# Altium schematic sheet Power_Supply.SchDoc: =SheetTitle_Top
size 420 x 297 mm; EDA_Number: ARTIQ; Author: G.Kasprowicz; CompanyName: WUT ISE; DrawnBy: G.Kasprowicz; Organization: WUT ISE; Address1: PW ISE; Address2: Nowowiejska 15/19 00-665 Warsaw; Address3: gkasprow@gmail.com; ModifiedBy: -; CheckedDate: -; Title2: Power Supply; DivGrp: WUT ISE; Designer: G.Kasprowicz; ModifiedDate: -; ProjectName: Sensor Box
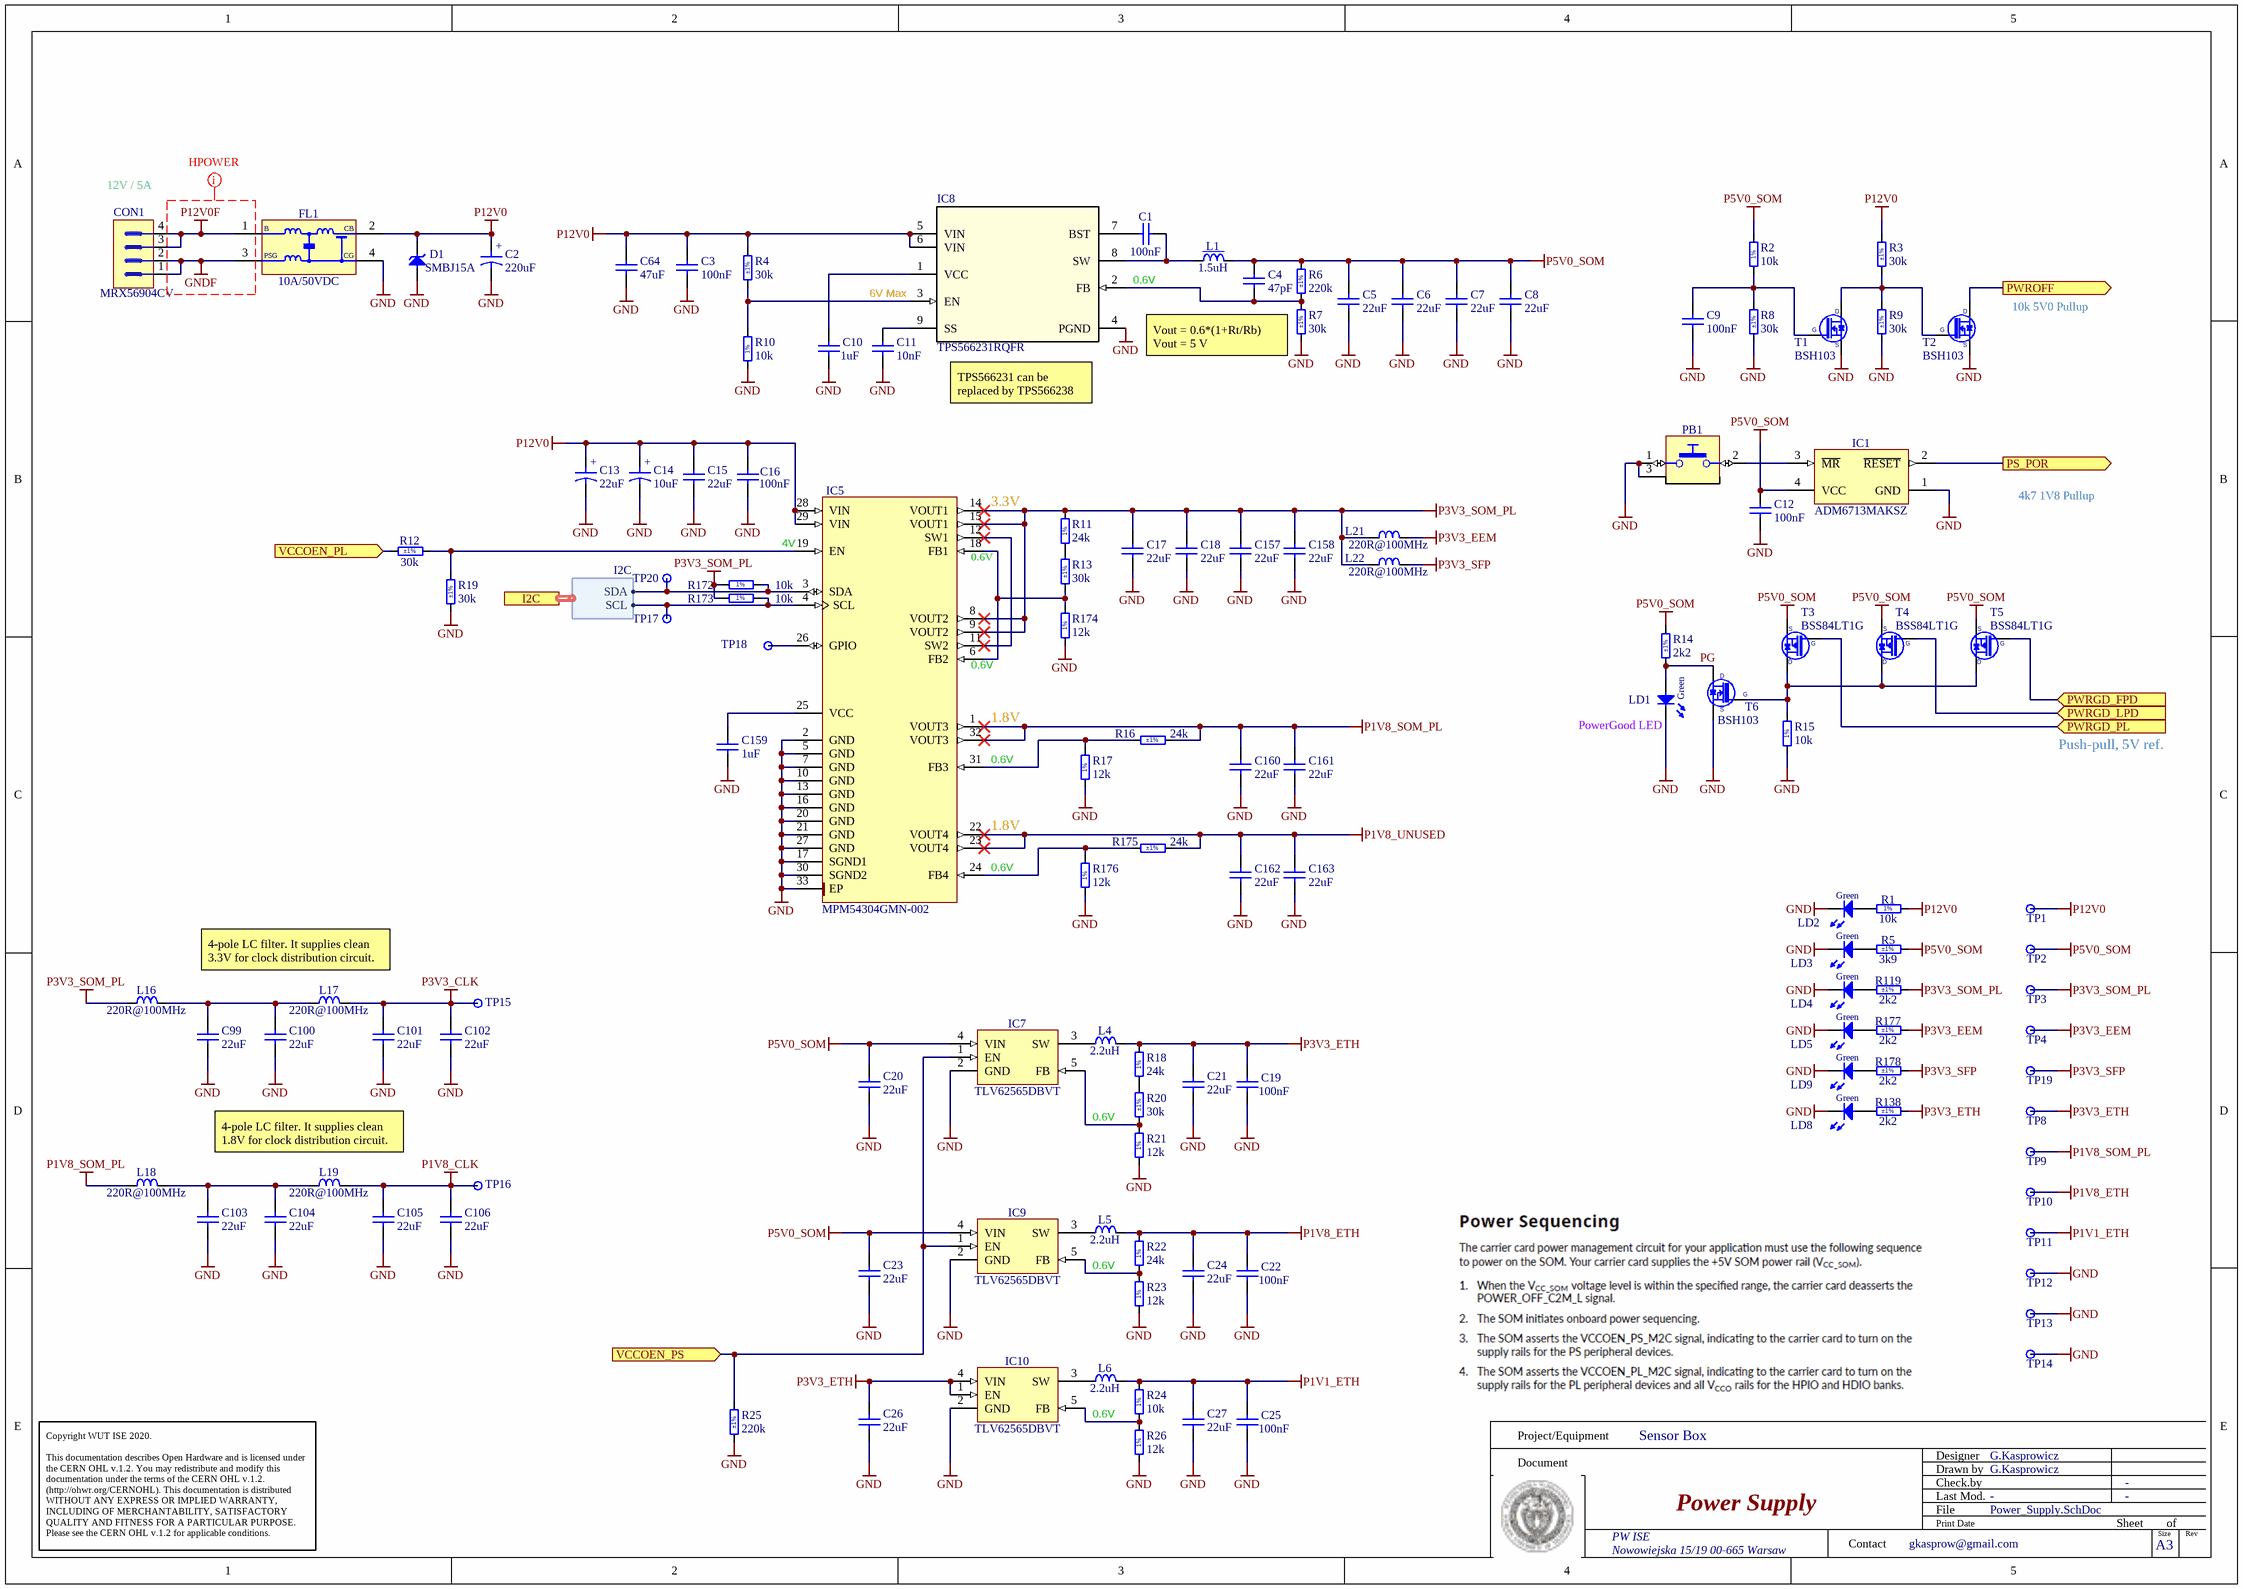
[diagram p0: Power_Supply.SchDoc]

## Parts
C1  100nF  [CAPC1005X55N]
C2  220uF  [CAPAE830X620N]
C3  100nF  [CAPC1005X55N]
C4  47pF  [CAPC1005X55N]
C5  22uF  [CAPC2012X135N]
C6  22uF  [CAPC2012X135N]
C7  22uF  [CAPC2012X135N]
C8  22uF  [CAPC2012X135N]
C9  100nF  [CAPC1005X55N]
C10  1uF  [CAPC1005X55N]
C11  10nF  [CAPC1005X55N]
C12  100nF  [CAPC1005X55N]
C13  22uF  [CAPMP3528X210N]
C14  10uF  [CAPMP3216X180N]
C15  22uF  [CAPC2012X135N]
C16  100nF  [CAPC1005X55N]
C17  22uF  [CAPC2012X135N]
C18  22uF  [CAPC2012X135N]
C19  100nF  [CAPC1005X55N]
C20  22uF  [CAPC2012X135N]
C21  22uF  [CAPC2012X135N]
C22  100nF  [CAPC1005X55N]
C23  22uF  [CAPC2012X135N]
C24  22uF  [CAPC2012X135N]
C25  100nF  [CAPC1005X55N]
C26  22uF  [CAPC2012X135N]
C27  22uF  [CAPC2012X135N]
C64  47uF  [CAPC3216X180N]
C99  22uF  [CAPC1709X100N]
C100  22uF  [CAPC1709X100N]
C101  22uF  [CAPC1709X100N]
C102  22uF  [CAPC1709X100N]
C103  22uF  [CAPC1709X100N]
C104  22uF  [CAPC1709X100N]
C105  22uF  [CAPC1709X100N]
C106  22uF  [CAPC1709X100N]
C157  22uF  [CAPC2012X135N]
C158  22uF  [CAPC2012X135N]
C159  1uF  [CAPC1005X55N]
C160  22uF  [CAPC2012X135N]
C161  22uF  [CAPC2012X135N]
C162  22uF  [CAPC2012X135N]
C163  22uF  [CAPC2012X135N]
CON1  MRX56904CV  [MRX56904CV]
D1  SMBJ15A  [DIOM5336X265N]
FL1  10A/50VDC  [FIL_MURATA_BNX02]
IC1  ADM6713MAKSZ  [SOT130P210X110-4N_a]
IC5  MPM54304GMN-002  [MPS_MPM54304GMN]
IC7  TLV62565DBVT  [SOT95P280X145-5N]
IC8  TPS566231RQFR  [RQF0009A]
IC9  TLV62565DBVT  [SOT95P280X145-5N]
IC10  TLV62565DBVT  [SOT95P280X145-5N]
L1  1.5uH  [IND_COILCRAFT_XAL4020]
L4  2.2uH  [IND_WURTH_WE-PMCI_0806LR]
L5  2.2uH  [IND_WURTH_WE-PMCI_0806LR]
L6  2.2uH  [IND_WURTH_WE-PMCI_0806LR]
L16  220R@100MHz  [INDC2012X105N]
L17  220R@100MHz  [INDC2012X105N]
L18  220R@100MHz  [INDC2012X105N]
L19  220R@100MHz  [INDC2012X105N]
L21  220R@100MHz  [INDC2012X105N]
L22  220R@100MHz  [INDC2012X105N]
LD1  Green  [LED_DIALIGHT_555-230]
LD2  Green  [LED_KINGBRIGHT_KPH-1608CGCK]
LD3  Green  [LED_KINGBRIGHT_KPH-1608CGCK]
LD4  Green  [LED_KINGBRIGHT_KPH-1608CGCK]
LD5  Green  [LED_KINGBRIGHT_KPH-1608CGCK]
LD8  Green  [LED_KINGBRIGHT_KPH-1608CGCK]
LD9  Green  [LED_KINGBRIGHT_KPH-1608CGCK]
PB1  (no value)  [PB_OMRON_B3U-1100P]
R1  10k  [RESC1005X40N]
R2  10k  [RESC1005X40N]
R3  30k  Tolerance: ±1%  [RESC1005X40N]
R4  30k  Tolerance: ±1%  [RESC1005X40N]
R5  3k9  Tolerance: ±1%  [RESC1005X40N]
R6  220k  Tolerance: ±1%  [RESC1005X40N]
R7  30k  Tolerance: ±1%  [RESC1005X40N]
R8  30k  Tolerance: ±1%  [RESC1005X40N]
R9  30k  Tolerance: ±1%  [RESC1005X40N]
R10  10k  [RESC1005X40N]
R11  24k  [RESC1005X40N]
R12  30k  Tolerance: ±1%  [RESC1005X40N]
R13  30k  Tolerance: ±1%  [RESC1005X40N]
R14  2k2  Tolerance: ±1%  [RESC1005X40N]
R15  10k  [RESC1005X40N]
R16  24k  Tolerance: ±1%  [RESC1005X40N]
R17  12k  [RESC1005X40N]
R18  24k  [RESC1005X40N]
R19  30k  Tolerance: ±1%  [RESC1005X40N]
R20  30k  Tolerance: ±1%  [RESC1005X40N]
R21  12k  [RESC1005X40N]
R22  24k  [RESC1005X40N]
R23  12k  [RESC1005X40N]
R24  10k  [RESC1005X40N]
R25  220k  Tolerance: ±1%  [RESC1005X40N]
R26  12k  [RESC1005X40N]
R119  2k2  Tolerance: ±1%  [RESC1005X40N]
R138  2k2  Tolerance: ±1%  [RESC1005X40N]
R172  10k  [RESC1005X40N]
R173  10k  [RESC1005X40N]
R174  12k  [RESC1005X40N]
R175  24k  Tolerance: ±1%  [RESC1005X40N]
R176  12k  [RESC1005X40N]
R177  2k2  Tolerance: ±1%  [RESC1005X40N]
R178  2k2  Tolerance: ±1%  [RESC1005X40N]
T1  BSH103  [SOT95P230X110-3N]
T2  BSH103  [SOT95P230X110-3N]
T3  BSS84LT1G  [SOT95P240X110-3N]
T4  BSS84LT1G  [SOT95P240X110-3N]
T5  BSS84LT1G  [SOT95P240X110-3N]
T6  BSH103  [SOT95P230X110-3N]
TP1  Test Point  [TPS127]  (value not drawn)  (no BOM)
TP2  Test Point  [TPS127]  (value not drawn)  (no BOM)
TP3  Test Point  [TPS127]  (value not drawn)  (no BOM)
TP4  Test Point  [TPS127]  (value not drawn)  (no BOM)
TP8  Test Point  [TPS127]  (value not drawn)  (no BOM)
TP9  Test Point  [TPS127]  (value not drawn)  (no BOM)
TP10  Test Point  [TPS127]  (value not drawn)  (no BOM)
TP11  Test Point  [TPS127]  (value not drawn)  (no BOM)
TP12  Test Point  [TPS127]  (value not drawn)  (no BOM)
TP13  Test Point  [TPS127]  (value not drawn)  (no BOM)
TP14  Test Point  [TPS127]  (value not drawn)  (no BOM)
TP15  Test Point  [TPS127]  (value not drawn)  (no BOM)
TP16  Test Point  [TPS127]  (value not drawn)  (no BOM)
TP17  Test Point  [TPS127]  (value not drawn)  (no BOM)
TP18  Test Point  [TPS127]  (value not drawn)  (no BOM)
TP19  Test Point  [TPS127]  (value not drawn)  (no BOM)
TP20  Test Point  [TPS127]  (value not drawn)  (no BOM)

## Ports
I2C (harness I2C), PS_POR (out), PWRGD_FPD (in), PWRGD_LPD (in), PWRGD_PL (in), PWROFF (out), VCCOEN_PL (in), VCCOEN_PS (in)

## Harnesses
I2C: SCL, SDA

## Nets
GND: C2.2 C3.1 C5.1 C6.1 C7.1 C8.1 C9.1 C10.1 C11.1 C12.1 C13.2 C14.2 C15.1 C16.1 C17.1 C18.1 C19.1 C20.1 C21.1 C22.1 C23.1 C24.1 C25.1 C26.1 C27.1 C64.1 C99.1 C100.1 C101.1 C102.1 C103.1 C104.1 C105.1 C106.1 C157.1 C158.1 C159.1 C160.1 C161.1 C162.1 C163.1 D1.2(A) FL1.4(CG) IC1.1(GND) IC5.2(GND) IC5.5(GND) IC5.7(GND) IC5.10(GND) IC5.13(GND) IC5.16(GND) IC5.17(SGND1) IC5.20(GND) IC5.21(GND) IC5.27(GND) IC5.30(SGND2) IC5.33(EP) IC7.2(GND) IC8.4(PGND) IC9.2(GND) IC10.2(GND) LD1.1(C) LD2.1(C) LD3.1(C) LD4.1(C) LD5.1(C) LD8.1(C) LD9.1(C) PB1.1 PB1.3 R7.1 R8.1 R9.1 R10.1 R15.1 R17.1 R19.1 R21.1 R23.1 R25.1 R26.1 R174.1 R176.1 T1.2(S) T2.2(S) T6.2(S) TP12.1 TP13.1 TP14.1
GNDF: CON1.1 CON1.2 FL1.3(PSG)
P1V1_ETH: C25.2 C27.2 L6.2 R24.2 TP11.1
P1V8_CLK: C105.2 C106.2 L19.2 TP16.1
P1V8_ETH: C22.2 C24.2 L5.2 R22.2 TP10.1
P1V8_SOM_PL: C160.2 C161.2 IC5.1(VOUT3) IC5.32(VOUT3) L18.1 R16.2 TP9.1
P1V8_UNUSED: C162.2 C163.2 IC5.22(VOUT4) IC5.23(VOUT4) R175.2
P3V3_CLK: C101.2 C102.2 L17.2 TP15.1
P3V3_EEM: L21.2 R177.2 TP4.1
P3V3_ETH: C19.2 C21.2 C26.2 IC10.1(EN) IC10.4(VIN) L4.2 R18.2 R138.2 TP8.1
P3V3_SFP: L22.2 R178.2 TP19.1
P3V3_SOM_PL: C17.2 C18.2 C157.2 C158.2 IC5.8(VOUT2) IC5.9(VOUT2) IC5.14(VOUT1) IC5.15(VOUT1) L16.1 L21.1 L22.1 R11.2 R119.2 R172.1 R173.1 TP3.1
P5V0_SOM: C4.2 C5.2 C6.2 C7.2 C8.2 C12.2 C20.2 C23.2 IC1.4(VCC) IC7.4(VIN) IC9.4(VIN) L1.2 R2.2 R5.2 R6.2 R14.2 T3.2(S) T4.2(S) T5.2(S) TP2.1
P12V0: C2.1 C3.2 C13.1 C14.1 C15.2 C16.2 C64.2 D1.1(C) FL1.2(CB) IC5.28(VIN) IC5.29(VIN) IC8.5(VIN) IC8.6(VIN) R1.2 R3.2 R4.2 TP1.1
P12V0F: CON1.3 CON1.4 FL1.1(B)
PG: LD1.2(A) R14.1 T6.3(D)
PS_POR: IC1.2(~{RESET}) ; port PS_POR
PWRGD_FPD: T5.1(G) ; port PWRGD_FPD
PWRGD_LPD: T4.1(G) ; port PWRGD_LPD
PWRGD_PL: T3.1(G) ; port PWRGD_PL
PWROFF: T2.3(D) ; port PWROFF
VCCOEN_PL: R12.1 ; port VCCOEN_PL
VCCOEN_PS: IC7.1(EN) IC9.1(EN) R25.2 ; port VCCOEN_PS
NetC1_1: C1.1 IC8.8(SW) L1.1
NetC1_2: C1.2 IC8.7(BST)
NetC4_1: C4.1 IC8.2(FB) R6.1 R7.2
NetC9_2: C9.2 R2.1 R8.2 T1.1(G)
NetC10_2: C10.2 IC8.1(VCC)
NetC11_2: C11.2 IC8.9(SS)
NetC99_2: C99.2 C100.2 L16.2 L17.1
NetC103_2: C103.2 C104.2 L18.2 L19.1
NetC159_2: C159.2 IC5.25(VCC)
NetIC1_3: IC1.3(~{MR}) PB1.2
NetIC5_3: IC5.3(SDA) R172.2 TP20.1 ; port I2C.SDA
NetIC5_4: IC5.4(SCL) R173.2 TP17.1 ; port I2C.SCL
NetIC5_6: IC5.6(FB2) IC5.18(FB1) R13.1 R174.2
NetIC5_11: IC5.11(SW2) IC5.12(SW1)
NetIC5_19: IC5.19(EN) R12.2 R19.2
NetIC5_24: IC5.24(FB4) R175.1 R176.2
NetIC5_26: IC5.26(GPIO) TP18.1
NetIC5_31: IC5.31(FB3) R16.1 R17.2
NetIC7_3: IC7.3(SW) L4.1
NetIC7_5: IC7.5(FB) R20.1 R21.2
NetIC8_3: IC8.3(EN) R4.1 R10.2
NetIC9_3: IC9.3(SW) L5.1
NetIC9_5: IC9.5(FB) R22.1 R23.2
NetIC10_3: IC10.3(SW) L6.1
NetIC10_5: IC10.5(FB) R24.1 R26.2
NetLD2_2: LD2.2(A) R1.1
NetLD3_2: LD3.2(A) R5.1
NetLD4_2: LD4.2(A) R119.1
NetLD5_2: LD5.2(A) R177.1
NetLD8_2: LD8.2(A) R138.1
NetLD9_2: LD9.2(A) R178.1
NetR3_1: R3.1 R9.2 T1.3(D) T2.1(G)
NetR11_1: R11.1 R13.2
NetR15_2: R15.2 T3.3(D) T4.3(D) T5.3(D) T6.1(G)
NetR18_1: R18.1 R20.2

## Layout directives
net class Hpower; rule Routing Via Style [Pref Size = 0.7mm    Pref Hole Size = 0.5mm]; rule Width Constraint [Pref Width = 20mil    Min Width = 15mil    Max Width = 50mil]: GNDF, P12V0F

## Notes on the sheet
- (near CON1) 12V / 5A
- 6V Max
- 0.6V
- (near T2) 10k 5V0 Pullup
- (near IC8) TPS566231 can be replaced by TPS566238
- (near R7) Vout = 0.6*(1+Rt/Rb)
  Vout = 5 V
- 3.3V
- 4k7 1V8 Pullup
- 4V
- (near IC5) 0.6V
- (near IC5) 1.8V
- (near LD1) PowerGood LED
- Push-pull, 5V ref.
- (near L17) 4-pole LC filter. It supplies clean 3.3V for clock distribution circuit.
- (near L19) 4-pole LC filter. It supplies clean 1.8V for clock distribution circuit.
- Project/Equipment
- Document
- Designer
- Drawn by
- Check.by
- Copyright WUT ISE 2020.
  This documentation describes Open Hardware and is licensed under the CERN OHL v.1.2. You may redistribute and modify this documentation under the terms of the CERN OHL v.1.2. (http://ohwr.org/CERNOHL). This documentation is distributed WITHOUT ANY EXPRESS OR IMPLIED WARRANTY, INCLUDING OF MERCHANTABILITY, SATISFACTORY QUALITY AND FITNESS FOR A PARTICULAR PURPOSE. Please see the CERN OHL v.1.2 for applicable conditions.
- Contact
- File
- Last Mod.
- Print Date
- Sheet
- Size
- A3
- of
- Rev
- (in symbol CAE830-620_220UF_16V_20%) +
- (in symbol CTE3216-18_10UF_16V_20%_AVX_TCJ) +
- (in symbol CTE3528-21_22UF_10V_10%_LESR0700) +
- (in symbol R0402_10K_1%_0.0625W_100PPM) 1%
- (in symbol R0402_12K_1%_0.0625W_100PPM) 1%
- (in symbol R0402_24K_1%_0.0625W_100PPM) 1%

## Library data of the parts
C1 C3 C9 C12 C16 C19 C22 C25 = CC0402_100NF_16V_10%_X5R: Non-polarised capacitor; Part Description: SMD Multilayer Chip Ceramic Capacitor; Manufacturer: GENERIC; Manufacturer1 Part Number: GRM155R61C104KA88D; Voltage: 16V; TC: X5R; Tolerance: ±10%; Part Number: CC0402_100NF_16V_10%_X5R; Component Kind: Standard; Component Type: Standard; Pin Count: 2; Value: 100nF; Status: None; Manufacturer Part Number: CC0402_100NF_16V_10%_X5R; Case: 0402; Mounted: Yes; Socket: No; SMD: Yes; Sense: No; Manufacturer1 Example: MURATA; Manufacturer1 ComponentHeight: 0.55mm; HelpURL: \\cern.ch\dfs\Applications\Altium\Datasheets\CC0402_X5R_MURATA_GRM.pdf; Author: CERN DEM JLC; CreateDate: 10.12.2013; LatestRevisionDate: 10.12.2013
C2 = CAE830-620_220UF_16V_20%: Polarised capacitor; Part Description: Aluminum Electrolytic SMT Capacitor; Manufacturer: PANASONIC; Manufacturer Part Number: EEEFK1C221AP; Voltage: 16V; Tolerance: ±20%; Part Number: CAE830-620_220UF_16V_20%; Component Kind: Standard; Component Type: Standard; Pin Count: 2; Value: 220uF; Status: Not Recommended; Case: E; Mounted: Yes; Socket: No; SMD: Yes; Sense: No; ComponentHeight: 6.2mm; HelpURL: \\cern.ch\dfs\Applications\Altium\Datasheets\CAE_PANASONIC_FK.pdf; Author: CERN DEM JLC; CreateDate: 03.12.2007; LatestRevisionDate: 05.11.2014
C4 = CC0402_47PF_50V_5%_C0G: Non-polarised capacitor; Part Description: SMD Multilayer Chip Ceramic Capacitor; Manufacturer: GENERIC; Manufacturer1 Part Number: C0402C470J5GACTU; Voltage: 50V; TC: C0G/NP0; Tolerance: ±5%; Part Number: CC0402_47PF_50V_5%_C0G; Component Kind: Standard; Component Type: Standard; Pin Count: 2; Value: 47pF; Status: Preferred; Manufacturer Part Number: CC0402_47PF_50V_5%_C0G; Case: 0402; Mounted: Yes; Socket: No; SMD: Yes; Sense: No; Manufacturer1 Example: KEMET; Manufacturer1 ComponentHeight: 0.55mm; HelpURL: \\cern.ch\dfs\Applications\Altium\Datasheets\CC0402_C0G_KEMET_(Commercial Grade).pdf; Author: CERN DEM JLC; CreateDate: 03.12.2007; LatestRevisionDate: 22.04.2015
C5-C8 C15 C17 C18 C157 C158 C160-C163 = CC0805_22UF_16V_10%_X5R: Non-polarised capacitor; Manufacturer: GENERIC; Part Description: SMD Multilayer Chip Ceramic Capacitor; Manufacturer1 Part Number: C2012X5R1C226KT; Tolerance: ±10%; Voltage: 16V; TC: X5R; Manufacturer Part Number: CC0805_22UF_16V_10%_X5R; Part Number: CC0805_22UF_16V_10%_X5R; Value: 22uF; Component Kind: Standard; Component Type: Standard; Pin Count: 2; Status: Preferred; Case: 0805; Mounted: Yes; Socket: No; SMD: Yes; Sense: No; Manufacturer1 Example: TDK; Manufacturer1 ComponentHeight: 1.35mm; HelpURL: \\cern.ch\dfs\Applications\Altium\Datasheets\CC0805_X5R_TDK_C.pdf; Author: CERN DEM JLC; CreateDate: 25.10.2012; LatestRevisionDate: 25.10.2012
C10 C159 = CC0402_1UF_16V_10%_X5R: Non-polarised capacitor; Part Description: SMD Multilayer Chip Ceramic Capacitor; Manufacturer: GENERIC; Manufacturer1 Part Number: C1005X5R1C105KT; Voltage: 16V; TC: X5R; Tolerance: ±10%; Part Number: CC0402_1UF_16V_10%_X5R; Component Kind: Standard; Component Type: Standard; Pin Count: 2; Value: 1uF; Status: Preferred; Manufacturer Part Number: CC0402_1UF_16V_10%_X5R; Case: 0402; Mounted: Yes; Socket: No; SMD: Yes; Sense: No; Manufacturer1 Example: TDK; Manufacturer1 ComponentHeight: 0.55mm; HelpURL: \\cern.ch\dfs\Applications\Altium\Datasheets\CC0402_X5R_TDK_C.pdf; Author: CERN DEM JLC
  C10: CreateDate: 2012-10-25; LatestRevisionDate: 2012-10-25
  C159: CreateDate: 25.10.2012; LatestRevisionDate: 25.10.2012
C11 = CC0402_10NF_16V_10%_X7R: Non-polarised capacitor; Part Description: SMD Multilayer Chip Ceramic Capacitor; Manufacturer: GENERIC; Manufacturer1 Part Number: 223878715636; Voltage: 16V; TC: X7R; Tolerance: ±10%; Part Number: CC0402_10NF_16V_10%_X7R; Component Kind: Standard; Component Type: Standard; Pin Count: 2; Value: 10nF; Status: Not Recommended; Manufacturer Part Number: CC0402_10NF_16V_10%_X7R; Case: 0402; Mounted: Yes; Socket: No; SMD: Yes; Sense: No; Manufacturer1 Example: PHYCOMP; Manufacturer1 ComponentHeight: 0.55mm; HelpURL: \\cern.ch\dfs\Applications\Altium\Datasheets\CC0402_X7R_PHYCOMP.pdf; Author: CERN DEM JLC; CreateDate: 03.12.2007; LatestRevisionDate: 03.12.2007
C13 = CTE3528-21_22UF_10V_10%_LESR0700: Polarised capacitor; Part Description: Low ESR 0R7 Solid Tantalum Chip Capacitor; Manufacturer: GENERIC; Manufacturer1 Part Number: TPSB226K010R0700; Voltage: 10V; Tolerance: ±10%; Part Number: CTE3528-21_22UF_10V_10%_LESR0700; Component Kind: Standard; Component Type: Standard; Pin Count: 2; Value: 22uF; Status: Preferred; Manufacturer Part Number: CTE3528-21_22UF_10V_10%_LESR0700; Case: B; Mounted: Yes; Socket: No; SMD: Yes; Sense: No; Manufacturer1 Example: AVX; Manufacturer1 ComponentHeight: 2.1mm; HelpURL: \\cern.ch\dfs\Applications\Altium\Datasheets\CTE-LESR_AVX_TPS.pdf; Author: CERN DEM JLC; CreateDate: 05.05.2008; LatestRevisionDate: 20.01.2009
C14 = CTE3216-18_10UF_16V_20%_AVX_TCJ: Polarised capacitor; Part Description: ESR 0R200 Tantalum Solid Electrolytic Chip Capacitor with Conductive Polymer Electrode; Manufacturer: AVX; Manufacturer Part Number: TCJA106M016R0200; Voltage: 16V; Tolerance: ±20%; Part Number: CTE3216-18_10UF_16V_20%_AVX_TCJ; Component Kind: Standard; Component Type: Standard; Pin Count: 2; Value: 10uF; Status: Preferred; Case: A; Mounted: Yes; Socket: No; SMD: Yes; Sense: No; ComponentHeight: 1.8mm; HelpURL: \\cern.ch\dfs\Applications\Altium\Datasheets\CTE_AVX_TCJ.pdf; Author: CERN DEM JLC; CreateDate: 29.03.2012; LatestRevisionDate: 29.03.2012
C20 C21 C23 C24 C26 C27 = CC0805_22UF_16V_10%_X5R: Non-polarised capacitor; Part Description: SMD Multilayer Chip Ceramic Capacitor; Manufacturer: GENERIC; Manufacturer1 Part Number: C2012X5R1C226KT; Voltage: 16V; TC: X5R; Tolerance: ±10%; Part Number: CC0805_22UF_16V_10%_X5R; Component Kind: Standard; Component Type: Standard; Pin Count: 2; Value: 22uF; Status: Preferred; Manufacturer Part Number: CC0805_22UF_16V_10%_X5R; Case: 0805; Mounted: Yes; Socket: No; SMD: Yes; Sense: No; Manufacturer1 Example: TDK; Manufacturer1 ComponentHeight: 1.35mm; HelpURL: \\cern.ch\dfs\Applications\Altium\Datasheets\CC0805_X5R_TDK_C.pdf; Author: CERN DEM JLC; CreateDate: 25.10.2012; LatestRevisionDate: 25.10.2012
C64 = CC1206_47UF_25V_20%_X5R: Non-polarised capacitor; Part Description: SMD Multilayer Chip Ceramic Capacitor; Manufacturer: GENERIC; Manufacturer1 Part Number: C3216X5R1E476M160AC; Voltage: 25V; TC: X5R; Tolerance: ±20%; Part Number: CC1206_47UF_25V_20%_X5R; Component Kind: Standard; Component Type: Standard; Pin Count: 2; Value: 47uF; Status: None; Manufacturer Part Number: CC1206_47UF_25V_20%_X5R; Case: 1206; Mounted: Yes; Socket: No; SMD: Yes; Sense: No; Manufacturer1 Example: TDK; Manufacturer1 ComponentHeight: 1.8mm; HelpURL: \\cern.ch\dfs\Applications\Altium\Datasheets\CC1206_X5R_TDK_C.pdf; Author: CERN DEM JLC; CreateDate: 20.11.2013; LatestRevisionDate: 14.03.2017
C99-C106 = CC0603_22UF_6.3V_20%_X5R: Non-polarised capacitor; Part Description: SMD Multilayer Chip Ceramic Capacitor; Manufacturer: GENERIC; Manufacturer1 Part Number: C1608X5R0J226M080AC; Voltage: 6.3V; TC: X5R; Tolerance: ±20%; Part Number: CC0603_22UF_6.3V_20%_X5R; Component Kind: Standard; Component Type: Standard; Pin Count: 2; Value: 22uF; Status: None; Manufacturer Part Number: CC0603_22UF_6.3V_20%_X5R; Case: 0603; Mounted: Yes; Socket: No; SMD: Yes; Manufacturer1 Example: TDK; Manufacturer1 ComponentHeight: 1mm; HelpURL: \\cern.ch\dfs\Applications\Altium\Datasheets\CC0603_X5R_TDK_C.pdf; Author: CERN DEM JLC; CreateDate: 16/12/2013; LatestRevisionDate: 13/09/2016; Sense: No
CON1 = CON_CRIMP_4.2mm_RA_4: 4.2mm cripm terminal header; Manufacturer: Molex; Part Number: MRX56904CV; Manufacturer Part Number: MRX56904CV
D1 = SMBJ15A: Zener Diode; Part Description: Uni-Directional Transient Voltage Suppressor Diode; Manufacturer: FAIRCHILD SEMICONDUCTOR; Voltage: 15V; Power: 600W; PressFit: No; Bonding: No; Part Number: SMBJ15A; Component Kind: Standard; Component Type: Standard; Device: SMBJ15A; PackageDescription: DO-214-AA/SMB Diode, Molded Body; 5.34mm L X 3.625mm W X 2.65mm H, IPC Medium Density; Manufacturer Part Number: SMBJ15A; Pin Count: 2; Case: DO-214AA; Mounted: Yes; Socket: No; SMD: Yes; Sense: No; ComponentHeight: 2.65mm; HelpURL: \\cern.ch\dfs\Applications\Altium\Datasheets\SMBJ.pdf; Author: CERN DEM JLC; CreateDate: 08.12.2008; LatestRevisionDate: 19.12.2011
FL1 = FIL_MURATA_BNX022-01L: Block Type EMIFIL (LC Combined); Part Description: Block Type EMIFIL (LC Combined) SMD Type, BNX02* Series; Manufacturer: MURATA; Resistance: 0.5R; Part Number: FIL_MURATA_BNX022-01L; Component Kind: Standard; Component Type: Standard; Pin Count: 2; Value: 10A/50VDC; Status: None; Manufacturer Part Number: BNX022-01L; Mounted: Yes; Socket: No; SMD: Yes; Sense: No; ComponentHeight: 3.3mm; HelpURL: \\cern.ch\dfs\Applications\Altium\Datasheets\FIL_MURATA_BNX022-01L.pdf; Author: CERN DEM JLC; CreateDate: 10.10.2012; LatestRevisionDate: 10.10.2012
IC1 = ADM6713MAKSZ: Microprocessor Supervisory with Manual Reset; Part Description: 4.38V Supervisory Circuits with Manual Reset; Manufacturer: ANALOG DEVICES; PressFit: No; Bonding: No; Part Number: ADM6713MAKSZ; Component Kind: Standard; Component Type: Standard; Device: ADM6713MAKSZ; PackageDescription: SC70-4, SOT, 0.65mm Pitch, 4 pin, 1.25mm W X 2.10mm L X 1.10mm H, IPC Medium Density, Big Pad 2; Manufacturer Part Number: ADM6713MAKSZ; Pin Count: 4; Case: SC70-4; Mounted: Yes; Socket: No; SMD: Yes; Sense: No; ComponentHeight: 1.1mm; Author: CERN DEM MR; HelpURL: \\cern.ch\dfs\Applications\Altium\Datasheets\ADM6713.pdf; CreateDate: 11/01/2016; LatestRevisionDate: 21/08/2018
IC5 = MPM54304GMN-XXXX: Quad-Output Power Module with I2C and MTP; Part Description: 4V to 16V Input, Quad-Output Power Module with I2C and MTP; Manufacturer: MPS (MONOLITIC  POWER SYSTEMS); PressFit: No; Bonding: No; Part Number: MPM54304GMN-002; Component Kind: Standard; Component Type: Standard; Device: MPM54304GMN-002; PackageDescription: MPS LGA-33 Case, 0.65mm Pitch, Rect.; 32 Pin, 7.00mm L X 7.00mm W X 2.10mm H body (w/Thermal Tab 3.55 X 3.55mm); Manufacturer Part Number: MPM54304GMN-002; Pin Count: 33; Case: QFN32; Mounted: Yes; Socket: No; SMD: Yes; Sense: No; ComponentHeight: 2.1mm; HelpURL: \\cern.ch\dfs\Applications\Altium\Datasheets\MPM54304GMN.pdf; Author: CERN DEM BC; CreateDate: 09.11.2020; LatestRevisionDate: 23.11.2022
IC7 IC9 IC10 = TLV62565DBVT: 1.5A High Efficiency Step-Down Converter, Adjustable Output Voltage; Manufacturer: TEXAS INSTRUMENTS; PressFit: No; Bonding: No; Part Number: TLV62565DBVT; Component Kind: Standard; Component Type: Standard; Device: TLV62565DBVT; PackageDescription: SOT, 0.95mm Pitch; 5 Pin, 1.60mm W X 2.90mm L X 1.45mm H Body, IPC Medium Density; Part Description: 1.5A High Efficiency Step-Down Converter, Adjustable Output Voltage; Manufacturer Part Number: TLV62565DBVT; Pin Count: 5; Case: SOT23-5; Mounted: Yes; Socket: No; SMD: Yes; Sense: No; ComponentHeight: 1.45mm; HelpURL: \\cern.ch\dfs\Applications\Altium\Datasheets\TLV62565DBVT.pdf; Author: CERN DEM JMW; CreateDate: 29.08.2016; LatestRevisionDate: 29.08.2016
IC8 = PM_TPS566231RQFR: 3-V to 18-V input, 6-A synchronous step-down voltage regulator with pulse skip mode; Manufacturer: Texas Instruments; PartNumber: TPS566231RQFR; RefDes: RefDes; Type: DEV; Value: Value; Copyright: Copyright (C) 2021 Accelerated Designs. All rights reserved
L1 = IND_1.5UH_20%_COILCRAFT_XAL4020: Inductor With Core; Part Description: SMD Shielded Power Inductor; Manufacturer Part Number: XAL4030-152ME; Power: 5.2A; Resistance: 0.02145R; Tolerance: ±20%; Part Number: IND_1.5UH_20%_COILCRAFT_XAL4020; Component Kind: Standard; Component Type: Standard; Pin Count: 2; Value: 1.5uH; Status: None; Manufacturer: COILCRAFT; Mounted: Yes; Socket: No; SMD: Yes; Sense: No; ComponentHeight: 2.1mm; HelpURL: \\cern.ch\dfs\Applications\Altium\Datasheets\IND_COILCRAFT_XAL4020.pdf; Author: CERN DEM BC; CreateDate: 07.08.2019; LatestRevisionDate: 07.08.2019
L4-L6 = IND_2.2UH_20%_WURTH_WE-PMCI_74479276222C: Inductor; Part Description: SMD Power Molded Chip  Inductor (WE-PMCI Series); Manufacturer: WURTH ELEKTRONIK; Power: 1.1A; Resistance: 0.112R; Tolerance: ±20%; Part Number: IND_2.2UH_20%_WURTH_WE-PMCI_74479276222C; Component Kind: Standard; Component Type: Standard; Pin Count: 2; Value: 2.2uH; Status: None; Manufacturer Part Number: 74479276222C; Case: 0806; Mounted: Yes; Socket: No; SMD: Yes; Sense: No; ComponentHeight: 1mm; HelpURL: \\cern.ch\dfs\Applications\Altium\Datasheets\IND_WURTH_WE-PMCI_74479276222C.pdf; Author: CERN DEM JLC; CreateDate: 20.10.2016; LatestRevisionDate: 20.10.2016
L16-L19 L21 L22 = IND0805_MURATA_BLM21PG221SN1D: Inductor; Part Description: SMD EMIFIL Suppression Chip Ferrite Bead; Manufacturer: MURATA; Power: 2A; Resistance: 0.05R; Tolerance: ±25%; Table: Inductors SMD; Part Number: IND0805_MURATA_BLM21PG221SN1D; Component Kind: Standard; Component Type: Standard; Pin Count: 2; Value: 220R@100MHz; Status: None; Manufacturer Part Number: BLM21PG221SN1D; Case: 0805; Mounted: Yes; Socket: No; SMD: Yes; ComponentHeight: 1.05mm; HelpURL: \\cern.ch\dfs\Applications\Altium\Datasheets\IND0402_MURATA_BLM21P.pdf; Author: CERN DEM JLC; CreateDate: 25/01/2010; LatestRevisionDate: 25/01/2010
LD1 = LED_DIALIGHT_555-2301F: LED Green 1C 2A; Part Description: Single 2mm Green LED CBI® Circuit Board Indicator; PressFit: No; Bonding: No; Part Number: LED_DIALIGHT_555-2301F; Component Kind: Standard; Component Type: Standard; Color: Green; PackageDescription: Single 2mm Green LED, Body 5.08x2.54mm, Pin spacing 2.54mm; Manufacturer: DIALIGHT; Manufacturer Part Number: 555-2301F; Pin Count: 2; Mounted: Yes; Socket: No; SMD: No; Sense: No; ComponentHeight: 6.35mm; HelpURL: \\cern.ch\dfs\Applications\Altium\Datasheets\LED_DIALIGHT_555-2301F.pdf; Author: CERN DEM JMW; CreateDate: 22.09.2008; LatestRevisionDate: 17.03.2010
LD2-LD5 LD8 LD9 = LED_KINGBRIGHT_KPH-1608CGCK: LED Green 1C 2A; Part Description: SMD Green LED, Case 1.6mmX0.8mm(0603), 0.65mm Thickness; PressFit: No; Bonding: No; Part Number: LED_KINGBRIGHT_KPH-1608CGCK; Component Kind: Standard; Component Type: Standard; Color: Green; PackageDescription: SMT Green LED, Case 0603, Body L 1.6 x W 0.8mm H 0.65mm; Manufacturer: KINGBRIGHT; Manufacturer Part Number: KPH-1608CGCK; Pin Count: 2; Mounted: Yes; Socket: No; SMD: Yes; Sense: No; ComponentHeight: 0.65mm; HelpURL: \\cern.ch\dfs\Applications\Altium\Datasheets\LED_KINGBRIGHT_KPH-1608CGCK.pdf; Author: CERN DEM JLC; CreateDate: 03/07/2017; LatestRevisionDate: 03/07/2017
PB1 = PB_OMRON_B3U-1100P: Push-Button Switch SPDT; Part Description: 3x2.5mm Ultra-Small Tactile SPST Pushbutton Switch (with Ground Terminal),Contact Rating 50mA 12VDC, B3U Series; Manufacturer: OMRON; PressFit: No; Part Number: PB_OMRON_B3U-1100P; Component Kind: Standard; Component Type: Standard; Pin Count: 3; PackageDescription: Body 1.2x3x2.5mm Ultra-Small Tactile SPST Pushbutton Switch, (with Ground Terminal), OMRON B3U Series; Family: Push Button; Mounted: Yes; Socket: No; SMD: Yes; Sense: No; Status: None; Manufacturer Part Number: B3U-1100P; ComponentHeight: 1.75mm; HelpURL: \\cern.ch\dfs\Applications\Altium\Datasheets\PB_OMRON_B3U-1100P.pdf; Author: CERN DEM JLC; CreateDate: 3/16/2010; LatestRevisionDate: 6/16/2022
R1 R2 R10 R15 R24 R172 R173 = R0402_10K_1%_0.0625W_100PPM: Resistor - 1%; Part Description: General Purpose Thick Film Chip Resistor; Manufacturer: GENERIC; Manufacturer1 Part Number: 232270671003L; TC: ±100ppm/°C; PressFit: No; Part Number: R0402_10K_1%_0.0625W_100PPM; Component Kind: Standard; Component Type: Standard; Pin Count: 2; Value: 10k; Status: Not Recommended; Power: 0.0625W; Tolerance: ±1%; Manufacturer Part Number: R0402_10K_1%_0.0625W_100PPM; Case: 0402; Mounted: Yes; Sense: No; Socket: No; SMD: Yes; Manufacturer1 Example: YAGEO PHYCOMP; Manufacturer1 ComponentHeight: 0.4mm; HelpURL: \\cern.ch\dfs\Applications\Altium\Datasheets\R0402_Phycomp_RC0402.pdf; Author: CERN DEM JLC; CreateDate: 03.12.2007; LatestRevisionDate: 17.10.2012
R3 R4 R7-R9 R12 R13 R19 R20 = R0402_30K_1%_0.0625W_100PPM: Resistor - 1%; Part Description: General Purpose Thick Film Chip Resistor; Manufacturer: GENERIC; Manufacturer1 Part Number: 232270673003L; TC: ±100ppm/°C; PressFit: No; Part Number: R0402_30K_1%_0.0625W_100PPM; Component Kind: Standard; Component Type: Standard; Pin Count: 2; Value: 30k; Status: Not Recommended; Power: 0.0625W; Manufacturer Part Number: R0402_30K_1%_0.0625W_100PPM; Case: 0402; Mounted: Yes; Sense: No; Socket: No; SMD: Yes; Manufacturer1 Example: YAGEO PHYCOMP; Manufacturer1 ComponentHeight: 0.4mm; HelpURL: \\cern.ch\dfs\Applications\Altium\Datasheets\R0402_Phycomp_RC0402.pdf; Author: CERN DEM JLC; CreateDate: 03.12.2007; LatestRevisionDate: 17.10.2012
R5 = R0402_3K9_1%_0.0625W_100PPM: Resistor - 1%; Part Description: General Purpose Thick Film Chip Resistor; Manufacturer: GENERIC; Manufacturer1 Part Number: 232270673902L; TC: ±100ppm/°C; PressFit: No; Part Number: R0402_3K9_1%_0.0625W_100PPM; Component Kind: Standard; Component Type: Standard; Pin Count: 2; Value: 3k9; Status: Not Recommended; Power: 0.0625W; Manufacturer Part Number: R0402_3K9_1%_0.0625W_100PPM; Case: 0402; Mounted: Yes; Sense: No; Socket: No; SMD: Yes; Manufacturer1 Example: YAGEO PHYCOMP; Manufacturer1 ComponentHeight: 0.4mm; HelpURL: \\cern.ch\dfs\Applications\Altium\Datasheets\R0402_Phycomp_RC0402.pdf; Author: CERN DEM JLC; CreateDate: 03.12.2007; LatestRevisionDate: 17.10.2012
R6 R25 = R0402_220K_1%_0.0625W_100PPM: Resistor - 1%; Part Description: General Purpose Thick Film Chip Resistor; Manufacturer: GENERIC; Manufacturer1 Part Number: 232270672204L; TC: ±100ppm/°C; PressFit: No; Part Number: R0402_220K_1%_0.0625W_100PPM; Component Kind: Standard; Component Type: Standard; Pin Count: 2; Value: 220k; Status: Not Recommended; Power: 0.0625W; Manufacturer Part Number: R0402_220K_1%_0.0625W_100PPM; Case: 0402; Mounted: Yes; Sense: No; Socket: No; SMD: Yes; Manufacturer1 Example: YAGEO PHYCOMP; Manufacturer1 ComponentHeight: 0.4mm; HelpURL: \\cern.ch\dfs\Applications\Altium\Datasheets\R0402_Phycomp_RC0402.pdf; Author: CERN DEM JLC; CreateDate: 03.12.2007; LatestRevisionDate: 17.10.2012
R11 R16 R18 R22 R175 = R0402_24K_1%_0.0625W_100PPM: Resistor - 1%; Part Description: General Purpose Thick Film Chip Resistor; Manufacturer: GENERIC; Manufacturer1 Part Number: 232270672403L; TC: ±100ppm/°C; PressFit: No; Part Number: R0402_24K_1%_0.0625W_100PPM; Component Kind: Standard; Component Type: Standard; Pin Count: 2; Value: 24k; Status: Not Recommended; Power: 0.0625W; Manufacturer Part Number: R0402_24K_1%_0.0625W_100PPM; Case: 0402; Mounted: Yes; Sense: No; Socket: No; SMD: Yes; Manufacturer1 Example: YAGEO PHYCOMP; Manufacturer1 ComponentHeight: 0.4mm; HelpURL: \\cern.ch\dfs\Applications\Altium\Datasheets\R0402_Phycomp_RC0402.pdf; Author: CERN DEM JLC
  R11 R18 R22: Tolerance: ±1%; CreateDate: 03/12/2007; LatestRevisionDate: 17/10/2012
  R16 R175: CreateDate: 03.12.2007; LatestRevisionDate: 17.10.2012
R14 R119 R138 R177 R178 = R0402_2K2_1%_0.0625W_100PPM: Resistor - 1%; Part Description: General Purpose Thick Film Chip Resistor; Manufacturer: GENERIC; Manufacturer1 Part Number: 232270672202L; TC: ±100ppm/°C; PressFit: No; Part Number: R0402_2K2_1%_0.0625W_100PPM; Component Kind: Standard; Component Type: Standard; Pin Count: 2; Value: 2k2; Status: Not Recommended; Power: 0.0625W; Manufacturer Part Number: R0402_2K2_1%_0.0625W_100PPM; Case: 0402; Mounted: Yes; Sense: No; Socket: No; SMD: Yes; Manufacturer1 Example: YAGEO PHYCOMP; Manufacturer1 ComponentHeight: 0.4mm; HelpURL: \\cern.ch\dfs\Applications\Altium\Datasheets\R0402_Phycomp_RC0402.pdf; Author: CERN DEM JLC; CreateDate: 03.12.2007; LatestRevisionDate: 17.10.2012
R17 R21 R23 R26 R174 R176 = R0402_12K_1%_0.0625W_100PPM: Resistor - 1%; Part Description: General Purpose Thick Film Chip Resistor; Manufacturer: GENERIC; Manufacturer1 Part Number: 232270671203L; TC: ±100ppm/°C; PressFit: No; Part Number: R0402_12K_1%_0.0625W_100PPM; Component Kind: Standard; Component Type: Standard; Pin Count: 2; Value: 12k; Status: Not Recommended; Power: 0.0625W; Tolerance: ±1%; Manufacturer Part Number: R0402_12K_1%_0.0625W_100PPM; Case: 0402; Mounted: Yes; Sense: No; Socket: No; SMD: Yes; Manufacturer1 Example: YAGEO PHYCOMP; Manufacturer1 ComponentHeight: 0.4mm; HelpURL: \\cern.ch\dfs\Applications\Altium\Datasheets\R0402_Phycomp_RC0402.pdf; Author: CERN DEM JLC; CreateDate: 03.12.2007; LatestRevisionDate: 17.10.2012
T1 T2 T6 = BSH103: N-CHANNEL MOSFET WITH DIODE; Part Description: 30V 850mA N-Channel Enhancement Mode Field-Effect Transistor; Manufacturer: NEXPERIA; PressFit: No; Bonding: No; Part Number: BSH103; Component Kind: Standard; Component Type: Standard; Device: BSH103; PackageDescription: SOT23, 0.95mm Pitch; 3 Pin, 1.30mm W X 2.90mm L X 1.10mm H body, IPC Medium Density; Manufacturer Part Number: BSH103; Pin Count: 3; Case: SOT23-3; Mounted: Yes; Socket: No; SMD: Yes; Sense: No; ComponentHeight: 1.1mm; HelpURL: \\cern.ch\dfs\Applications\Altium\Datasheets\BSH103.pdf; Author: CERN DEM JLC; CreateDate: 16.03.2010; LatestRevisionDate: 20.06.2017
T3-T5 = BSS84LT1G: P-CHANNEL MOSFET WITH DIODE; Part Description: 50V 130mA Single P-Channel Power MOSFET; Manufacturer: ON SEMICONDUCTOR; PressFit: No; Bonding: No; Part Number: BSS84LT1G; Component Kind: Standard; Component Type: Standard; Device: BSS84LT1G; PackageDescription: SOT23 3-Leads, Pitch 0.95mm - Body 1.4x3mm, IPC Medium Density; Manufacturer Part Number: BSS84LT1G; Pin Count: 3; Case: SOT23-3; Mounted: Yes; Socket: No; SMD: Yes; Sense: No; ComponentHeight: 1.1mm; HelpURL: \\cern.ch\dfs\Applications\Altium\Datasheets\BSS84LT1G.pdf; Author: CERN DEM JLC; CreateDate: 29.03.2012; LatestRevisionDate: 29.03.2012
TP1-TP4 TP8-TP20 = SMD_PAD_1.27X1.27MM: Part Description: 1.27mm x 1.27mm PCB Copper Area (SMD Test Point); Mounted: No; Part Number: SMD_PAD_1.27X1.27MM; Component Type: Standard (No BOM); Pin Count: 1; Family: Test Point; Socket: No; SMD: Yes; Sense: No; Status: None; ComponentHeight: 0mm; HelpURL: Undefined; Author: CERN DEM JLC; CreateDate: 12.01.2008; LatestRevisionDate: 12.01.2008; PackageDescription: 1.27mm x 1.27mm PCB Copper Area (SMD Test Point)